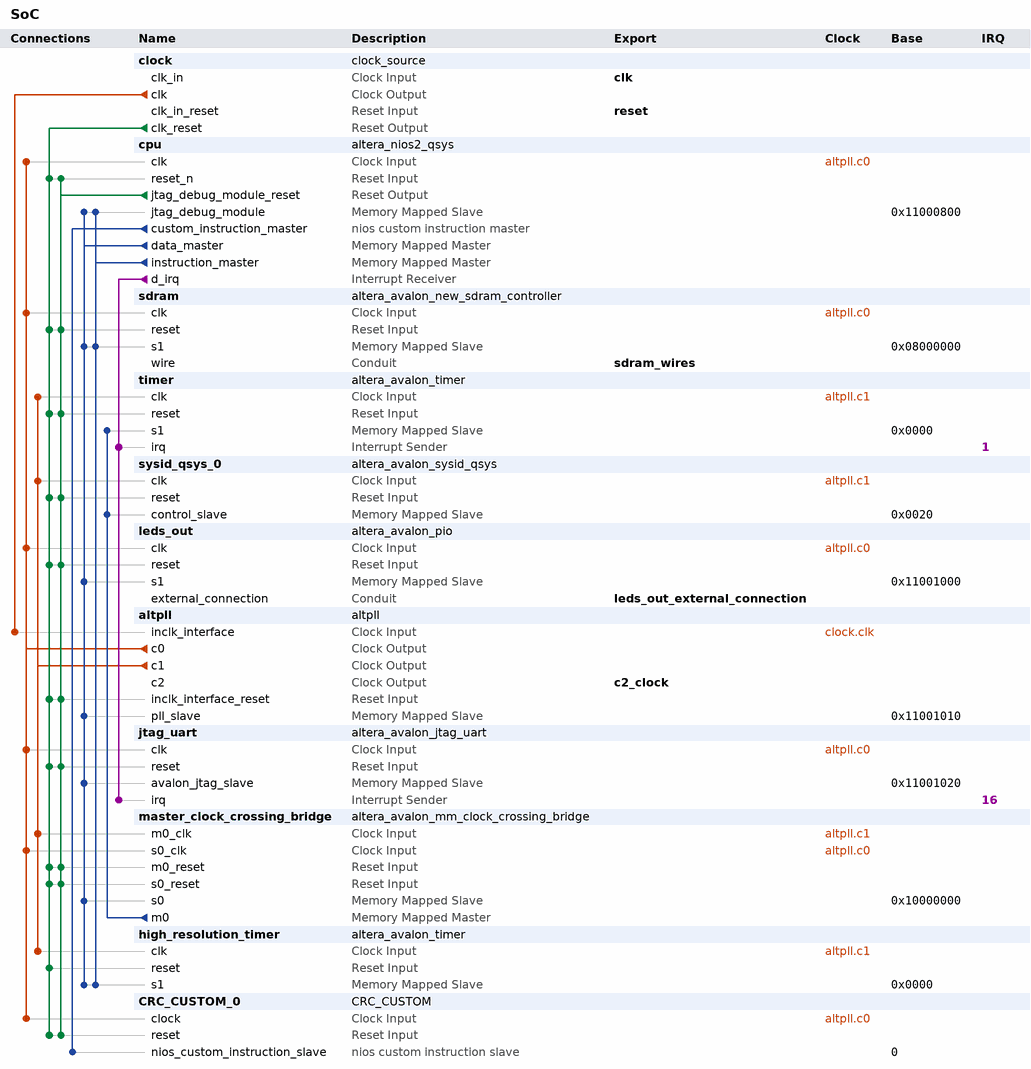
[diagram p0: system contents]
# Platform Designer (Qsys) system SoC, Cyclone IV E EP4CE115F29C7
# Parameters at their usual value, and those the tool derives, are not listed.
package require -exact qsys 13.1
create_system SoC
set_project_property DEVICE_FAMILY {Cyclone IV E}
set_project_property DEVICE EP4CE115F29C7

add_instance clock clock_source 13.1
set_instance_parameter_value clock clockFrequency 50000000

add_instance cpu altera_nios2_qsys 13.1
set_instance_parameter_value cpu resetSlave sdram.s1
set_instance_parameter_value cpu mmu_TLBMissExcSlave None
set_instance_parameter_value cpu exceptionSlave sdram.s1
set_instance_parameter_value cpu breakSlave cpu.jtag_debug_module
set_instance_parameter_value cpu impl Tiny
set_instance_parameter_value cpu icache_size 4096

add_instance sdram altera_avalon_new_sdram_controller 13.1
set_instance_parameter_value sdram TAC 6.0
set_instance_parameter_value sdram TRCD 20.0
set_instance_parameter_value sdram TRP 20.0
set_instance_parameter_value sdram casLatency 3
set_instance_parameter_value sdram columnWidth 10
set_instance_parameter_value sdram dataWidth 32
set_instance_parameter_value sdram generateSimulationModel false
set_instance_parameter_value sdram model single_Micron_MT48LC4M32B2_7_chip
set_instance_parameter_value sdram numberOfBanks 4
set_instance_parameter_value sdram numberOfChipSelects 1
set_instance_parameter_value sdram powerUpDelay 100.0
set_instance_parameter_value sdram refreshPeriod 15.625
set_instance_parameter_value sdram rowWidth 13

add_instance timer altera_avalon_timer 13.1
set_instance_parameter_value timer period 1
set_instance_parameter_value timer periodUnits MSEC

add_instance sysid_qsys_0 altera_avalon_sysid_qsys 13.1
set_instance_parameter_value sysid_qsys_0 id 0

add_instance leds_out altera_avalon_pio 13.1
set_instance_parameter_value leds_out direction Output
set_instance_parameter_value leds_out width 8

add_instance altpll altpll 13.1
set_instance_parameter_value altpll INCLK0_INPUT_FREQUENCY 20000
set_instance_parameter_value altpll CLK0_MULTIPLY_BY 2
set_instance_parameter_value altpll CLK1_MULTIPLY_BY 1
set_instance_parameter_value altpll CLK2_MULTIPLY_BY 2
set_instance_parameter_value altpll CLK0_DIVIDE_BY 1
set_instance_parameter_value altpll CLK1_DIVIDE_BY 5
set_instance_parameter_value altpll CLK2_DIVIDE_BY 1
set_instance_parameter_value altpll CLK1_PHASE_SHIFT 0
set_instance_parameter_value altpll CLK2_PHASE_SHIFT -1806
set_instance_parameter_value altpll CLK1_DUTY_CYCLE 50
set_instance_parameter_value altpll CLK2_DUTY_CYCLE 50
set_instance_parameter_value altpll PORT_clk1 PORT_USED
set_instance_parameter_value altpll PORT_clk2 PORT_USED
set_instance_parameter_value altpll PORT_clk3 PORT_UNUSED
set_instance_parameter_value altpll PORT_ARESET PORT_UNUSED
set_instance_parameter_value altpll PORT_LOCKED PORT_UNUSED

add_instance jtag_uart altera_avalon_jtag_uart 13.1
set_instance_parameter_value jtag_uart simInteractiveOptions NO_INTERACTIVE_WINDOWS

add_instance master_clock_crossing_bridge altera_avalon_mm_clock_crossing_bridge 13.1
set_instance_parameter_value master_clock_crossing_bridge DATA_WIDTH 32
set_instance_parameter_value master_clock_crossing_bridge ADDRESS_WIDTH 10
set_instance_parameter_value master_clock_crossing_bridge MAX_BURST_SIZE 1
set_instance_parameter_value master_clock_crossing_bridge COMMAND_FIFO_DEPTH 4
set_instance_parameter_value master_clock_crossing_bridge RESPONSE_FIFO_DEPTH 4
set_instance_parameter_value master_clock_crossing_bridge MASTER_SYNC_DEPTH 2
set_instance_parameter_value master_clock_crossing_bridge SLAVE_SYNC_DEPTH 2

add_instance high_resolution_timer altera_avalon_timer 13.1
set_instance_parameter_value high_resolution_timer period 1
set_instance_parameter_value high_resolution_timer periodUnits USEC

add_instance CRC_CUSTOM_0 CRC_CUSTOM 1.0
set_instance_parameter_value CRC_CUSTOM_0 crc_width 32
set_instance_parameter_value CRC_CUSTOM_0 polynomial_inital 4294967295
set_instance_parameter_value CRC_CUSTOM_0 polynomial 79764919
set_instance_parameter_value CRC_CUSTOM_0 reflected_input 1
set_instance_parameter_value CRC_CUSTOM_0 reflected_output 1
set_instance_parameter_value CRC_CUSTOM_0 xor_output 4294967295

# connections
add_connection altpll.c0 cpu.clk clock
add_connection altpll.c0 CRC_CUSTOM_0.clock clock
add_connection altpll.c0 jtag_uart.clk clock
add_connection altpll.c0 leds_out.clk clock
add_connection altpll.c0 master_clock_crossing_bridge.s0_clk clock
add_connection altpll.c0 sdram.clk clock
add_connection altpll.c1 high_resolution_timer.clk clock
add_connection altpll.c1 master_clock_crossing_bridge.m0_clk clock
add_connection altpll.c1 sysid_qsys_0.clk clock
add_connection altpll.c1 timer.clk clock
add_connection clock.clk altpll.inclk_interface clock
add_connection clock.clk_reset altpll.inclk_interface_reset reset
add_connection clock.clk_reset cpu.reset_n reset
add_connection clock.clk_reset CRC_CUSTOM_0.reset reset
add_connection clock.clk_reset high_resolution_timer.reset reset
add_connection clock.clk_reset jtag_uart.reset reset
add_connection clock.clk_reset leds_out.reset reset
add_connection clock.clk_reset master_clock_crossing_bridge.m0_reset reset
add_connection clock.clk_reset master_clock_crossing_bridge.s0_reset reset
add_connection clock.clk_reset sdram.reset reset
add_connection clock.clk_reset sysid_qsys_0.reset reset
add_connection clock.clk_reset timer.reset reset
add_connection cpu.jtag_debug_module_reset altpll.inclk_interface_reset reset
add_connection cpu.jtag_debug_module_reset cpu.reset_n reset
add_connection cpu.jtag_debug_module_reset CRC_CUSTOM_0.reset reset
add_connection cpu.jtag_debug_module_reset jtag_uart.reset reset
add_connection cpu.jtag_debug_module_reset leds_out.reset reset
add_connection cpu.jtag_debug_module_reset master_clock_crossing_bridge.m0_reset reset
add_connection cpu.jtag_debug_module_reset master_clock_crossing_bridge.s0_reset reset
add_connection cpu.jtag_debug_module_reset sdram.reset reset
add_connection cpu.jtag_debug_module_reset sysid_qsys_0.reset reset
add_connection cpu.jtag_debug_module_reset timer.reset reset
add_connection cpu.data_master altpll.pll_slave avalon
set_connection_parameter_value cpu.data_master/altpll.pll_slave baseAddress 0x11001010
add_connection cpu.data_master cpu.jtag_debug_module avalon
set_connection_parameter_value cpu.data_master/cpu.jtag_debug_module baseAddress 0x11000800
add_connection cpu.data_master high_resolution_timer.s1 avalon
set_connection_parameter_value cpu.data_master/high_resolution_timer.s1 baseAddress 0x0000
add_connection cpu.data_master jtag_uart.avalon_jtag_slave avalon
set_connection_parameter_value cpu.data_master/jtag_uart.avalon_jtag_slave baseAddress 0x11001020
add_connection cpu.data_master leds_out.s1 avalon
set_connection_parameter_value cpu.data_master/leds_out.s1 baseAddress 0x11001000
add_connection cpu.data_master master_clock_crossing_bridge.s0 avalon
set_connection_parameter_value cpu.data_master/master_clock_crossing_bridge.s0 baseAddress 0x10000000
add_connection cpu.data_master sdram.s1 avalon
set_connection_parameter_value cpu.data_master/sdram.s1 baseAddress 0x08000000
add_connection cpu.instruction_master cpu.jtag_debug_module avalon
set_connection_parameter_value cpu.instruction_master/cpu.jtag_debug_module baseAddress 0x11000800
add_connection cpu.instruction_master high_resolution_timer.s1 avalon
set_connection_parameter_value cpu.instruction_master/high_resolution_timer.s1 baseAddress 0x0000
add_connection cpu.instruction_master sdram.s1 avalon
set_connection_parameter_value cpu.instruction_master/sdram.s1 baseAddress 0x08000000
add_connection master_clock_crossing_bridge.m0 sysid_qsys_0.control_slave avalon
set_connection_parameter_value master_clock_crossing_bridge.m0/sysid_qsys_0.control_slave baseAddress 0x0020
add_connection master_clock_crossing_bridge.m0 timer.s1 avalon
set_connection_parameter_value master_clock_crossing_bridge.m0/timer.s1 baseAddress 0x0000
add_connection cpu.d_irq jtag_uart.irq interrupt
set_connection_parameter_value cpu.d_irq/jtag_uart.irq irqNumber 16
add_connection cpu.d_irq timer.irq interrupt
set_connection_parameter_value cpu.d_irq/timer.irq irqNumber 1
add_connection cpu.custom_instruction_master CRC_CUSTOM_0.nios_custom_instruction_slave nios_custom_instruction
set_connection_parameter_value cpu.custom_instruction_master/CRC_CUSTOM_0.nios_custom_instruction_slave CIName crc_custom_0
set_connection_parameter_value cpu.custom_instruction_master/CRC_CUSTOM_0.nios_custom_instruction_slave baseAddress 0

# exported interfaces
add_interface clk clock sink
set_interface_property clk EXPORT_OF clock.clk_in
add_interface reset reset sink
set_interface_property reset EXPORT_OF clock.clk_in_reset
add_interface sdram_wires conduit end
set_interface_property sdram_wires EXPORT_OF sdram.wire
add_interface leds_out_external_connection conduit end
set_interface_property leds_out_external_connection EXPORT_OF leds_out.external_connection
add_interface c2_clock clock source
set_interface_property c2_clock EXPORT_OF altpll.c2

set_interconnect_requirement {$system} qsys_mm.clockCrossingAdapter HANDSHAKE
set_interconnect_requirement {$system} qsys_mm.maxAdditionalLatency 1
set_interconnect_requirement {$system} qsys_mm.insertDefaultSlave false

save_system SoC.qsys
